# Altium project LimeSDR-PCIe_1v3.PrjPcb (part 3 of 7)

## Sheet 10_FPGA_misc.SchDoc: FPGA misc
size A4; Organization: Lime Microsystems; Address1: Surrey Tech Centre; Address2: Guildford GU2 7YG; Address3: Surrey; Address4: United Kingdom; Revision: v1.3; SheetNumber: 10; SheetTotal: 16
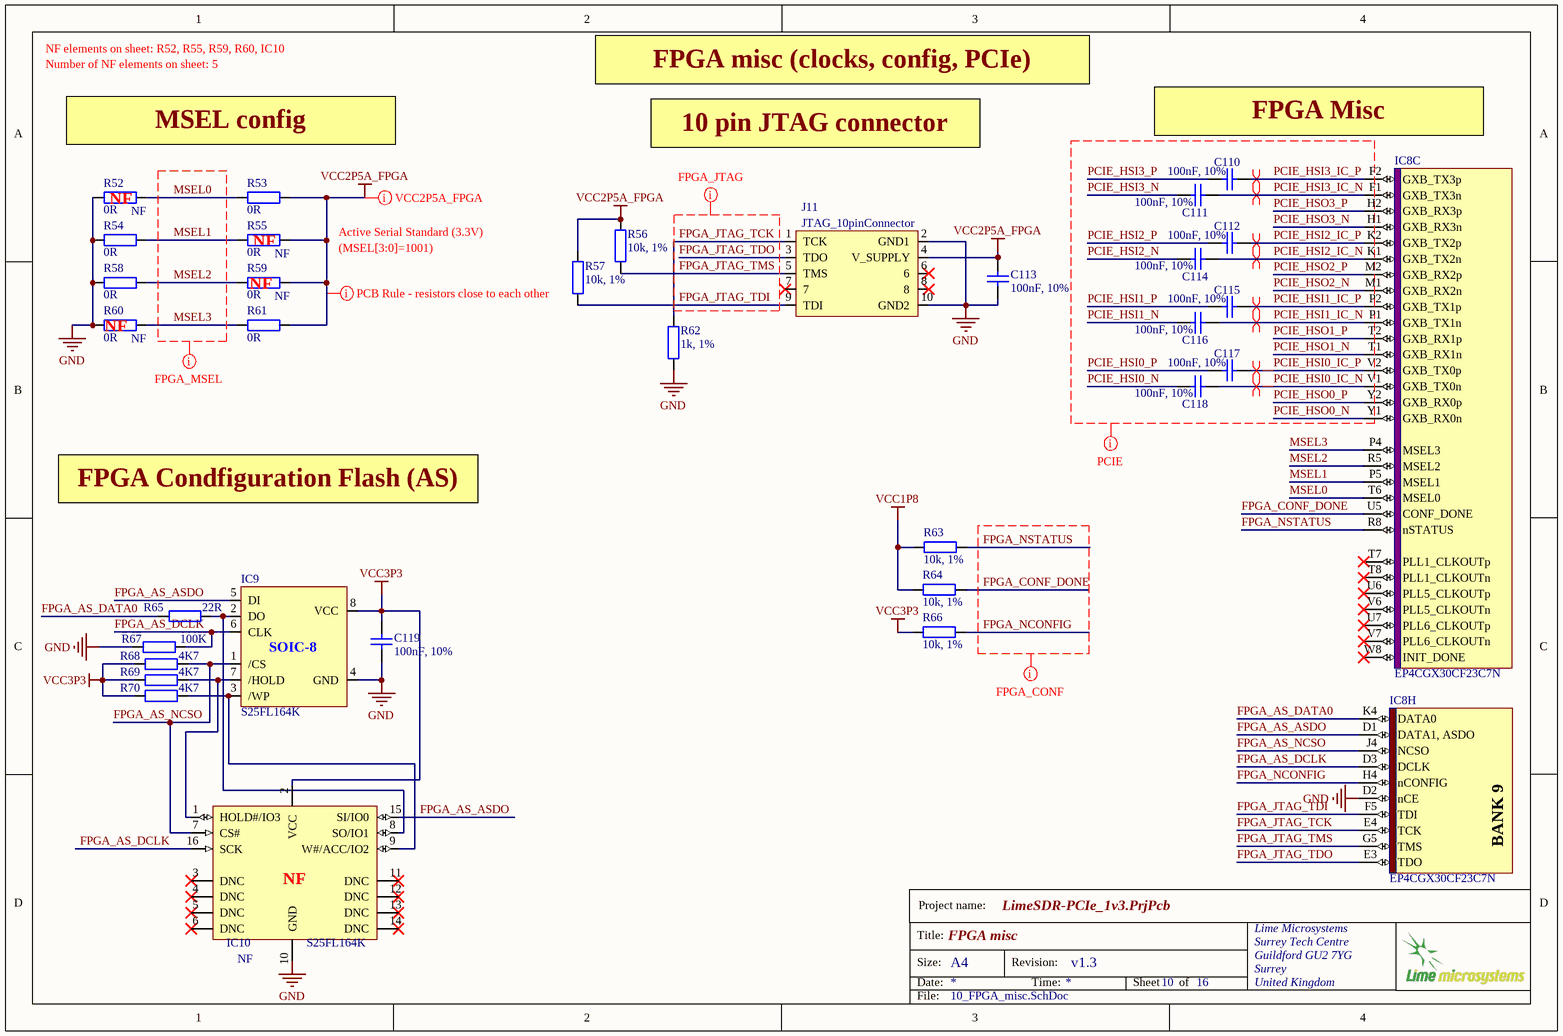
[diagram p10: 10_FPGA_misc.SchDoc]

### Parts
C110  100nF, 10%  [CAP0402]
C111  100nF, 10%  [CAP0402]
C112  100nF, 10%  [CAP0402]
C113  100nF, 10%  [CAP0402]
C114  100nF, 10%  [CAP0402]
C115  100nF, 10%  [CAP0402]
C116  100nF, 10%  [CAP0402]
C117  100nF, 10%  [CAP0402]
C118  100nF, 10%  [CAP0402]
C119  100nF, 10%  [CAP0402]
IC8  EP4CGX30CF23C7N  [ALTR-FBGA484_A-200]  (parts C,H of 10)
IC9  S25FL164K  [S25FL164K_WSO8N]
IC10  S25FL164K  Assembly Info: NF  [SOIC16_WIDE]
J11  JTAG_10pinConnector  [HEADER5x2_SM]
R52  0R  Assembly Info: NF  [RES0402]
R53  0R  [RES0402]
R54  0R  [RES0402]
R55  0R  Assembly Info: NF  [RES0402]
R56  10k, 1%  [RES0402]
R57  10k, 1%  [RES0402]
R58  0R  [RES0402]
R59  0R  Assembly Info: NF  [RES0402]
R60  0R  Assembly Info: NF  [RES0402]
R61  0R  [RES0402]
R62  1k, 1%  [RES0402]
R63  10k, 1%  [RES0402]
R64  10k, 1%  [RES0402]
R65  22R  [RES0402]
R66  10k, 1%  [RES0402]
R67  100K  [RES0402]
R68  4K7  [RES0402]
R69  4K7  [RES0402]
R70  4K7  [RES0402]

### Nets
GND: C113.2 C119.2 IC8.D2(nCE) IC9.4(GND) IC10.10(GND) J11.2(GND1) J11.10(GND2) R52.2 R54.2 R58.2 R60.2 R62.2 R67.2
VCC1P8: R63.1 R64.1
VCC2P5A_FPGA: C113.1 J11.4(V_SUPPLY) R53.1 R55.1 R56.1 R57.1 R59.1 R61.1
VCC3P3: C119.1 IC9.8(VCC) IC10.2(VCC) R66.1 R68.1 R69.1 R70.1
FPGA_AS_ASDO: IC8.D1(DATA1,_ASDO) IC9.5(DI) IC10.15(SI/IO0)
FPGA_AS_DATA0: IC8.K4(DATA0) R65.2
FPGA_AS_DCLK: IC8.D3(DCLK) IC9.6(CLK) IC10.16(SCK) R67.1
FPGA_AS_NCSO: IC8.J4(NCSO) IC9.1(/CS) IC10.7(CS#) R68.2
FPGA_CONF_DONE: IC8.U5(CONF_DONE) R64.2
FPGA_JTAG_TCK: IC8.E4(TCK) J11.1(TCK) R62.1
FPGA_JTAG_TDI: IC8.F5(TDI) J11.9(TDI) R57.2
FPGA_JTAG_TDO: IC8.E3(TDO) J11.3(TDO)
FPGA_JTAG_TMS: IC8.G5(TMS) J11.5(TMS) R56.2
FPGA_NCONFIG: IC8.H4(nCONFIG) R66.2
FPGA_NSTATUS: IC8.R8(nSTATUS) R63.2
MSEL0: IC8.T6(MSEL0) R52.1 R53.2
MSEL1: IC8.P5(MSEL1) R54.1 R55.2
MSEL2: IC8.R5(MSEL2) R58.1 R59.2
MSEL3: IC8.P4(MSEL3) R60.1 R61.2
PCIE_HSI0_IC_N: C118.1 IC8.V1(GXB_TX0n)
PCIE_HSI0_IC_P: C117.1 IC8.V2(GXB_TX0p)
PCIE_HSI0_N: C118.2
PCIE_HSI0_P: C117.2
PCIE_HSI1_IC_N: C116.1 IC8.P1(GXB_TX1n)
PCIE_HSI1_IC_P: C115.1 IC8.P2(GXB_TX1p)
PCIE_HSI1_N: C116.2
PCIE_HSI1_P: C115.2
PCIE_HSI2_IC_N: C114.1 IC8.K1(GXB_TX2n)
PCIE_HSI2_IC_P: C112.1 IC8.K2(GXB_TX2p)
PCIE_HSI2_N: C114.2
PCIE_HSI2_P: C112.2
PCIE_HSI3_IC_N: C111.1 IC8.F1(GXB_TX3n)
PCIE_HSI3_IC_P: C110.1 IC8.F2(GXB_TX3p)
PCIE_HSI3_N: C111.2
PCIE_HSI3_P: C110.2
PCIE_HSO0_N: IC8.Y1(GXB_RX0n)
PCIE_HSO0_P: IC8.Y2(GXB_RX0p)
PCIE_HSO1_N: IC8.T1(GXB_RX1n)
PCIE_HSO1_P: IC8.T2(GXB_RX1p)
PCIE_HSO2_N: IC8.M1(GXB_RX2n)
PCIE_HSO2_P: IC8.M2(GXB_RX2p)
PCIE_HSO3_N: IC8.H1(GXB_RX3n)
PCIE_HSO3_P: IC8.H2(GXB_RX3p)
NetIC9_2: IC9.2(DO) IC10.8(SO/IO1) R65.1
NetIC9_3: IC9.3(/WP) IC10.9(W#/ACC/IO2) R70.2
NetIC9_7: IC9.7(/HOLD) IC10.1(HOLD#/IO3) R69.2

Not connected (* = marked no-connect by the designer): IC8 T7(PLL1_CLKOUTp)* T8(PLL1_CLKOUTn)* U6(PLL5_CLKOUTp)* U7(PLL6_CLKOUTp)* V6(PLL5_CLKOUTn)* V7(PLL6_CLKOUTn)* W8(INIT_DONE)*; IC10 3(DNC)* 4(DNC)* 5(DNC)* 6(DNC)* 11(DNC)* 12(DNC)* 13(DNC)* 14(DNC)*; J11 6* 7* 8*

### Layout directives
net class FPGA_JTAG: FPGA_JTAG_TCK, FPGA_JTAG_TDI, FPGA_JTAG_TDO, FPGA_JTAG_TMS
net class FPGA_CONF: FPGA_CONF_DONE, FPGA_NCONFIG, FPGA_NSTATUS
rule Undefined: VCC2P5A_FPGA
net class FPGA_MSEL: MSEL0, MSEL1, MSEL2, MSEL3
differential pair: PCIE_HSI0_IC_N, PCIE_HSI0_IC_P, PCIE_HSI1_IC_N, PCIE_HSI1_IC_P, PCIE_HSI2_IC_N, PCIE_HSI2_IC_P, PCIE_HSI3_IC_N, PCIE_HSI3_IC_P
net class PCIE: PCIE_HSI0_IC_N, PCIE_HSI0_IC_P, PCIE_HSI0_N, PCIE_HSI0_P, PCIE_HSI1_IC_N, PCIE_HSI1_IC_P, PCIE_HSI1_N, PCIE_HSI1_P, PCIE_HSI2_IC_N, PCIE_HSI2_IC_P, PCIE_HSI2_N, PCIE_HSI2_P, PCIE_HSI3_IC_N, PCIE_HSI3_IC_P, PCIE_HSI3_N, PCIE_HSI3_P, PCIE_HSO0_N, PCIE_HSO0_P, PCIE_HSO1_N, PCIE_HSO1_P, PCIE_HSO2_N, PCIE_HSO2_P, PCIE_HSO3_N, PCIE_HSO3_P
net class VCC2P5A_FPGA: VCC2P5A_FPGA

### Notes on the sheet
- NF elements on sheet: R52, R55, R59, R60, IC10
- Number of NF elements on sheet: 5
- FPGA misc (clocks, config, PCIe)
- MSEL config
- 10 pin JTAG connector
- FPGA Misc
- (near R52) NF
- (near R55) NF
- Active Serial Standard (3.3V)
- (near R59) NF
- (MSEL[3:0]=1001)
- (near R60) NF
- FPGA Condfiguration Flash (AS)
- (near IC10) NF
- Project name:
- Title:
- Size:
- Date:
- A4
- Revision:
- Time:
- Sheet
- of
- File:
- (in symbol EP4CGX30CF23C7N, part H) BANK 9
- (in symbol W25Q32FV) SOIC-8

### Library data of the parts
C110 = Cap_0603: Part Description: 0.10µF ±10% 16V X7R Ceramic Capacitor -55°C ~ 125°C Surface Mount, MLCC 0402 (1005 Metric) 0.039" L x 0.020" W (1.00mm x 0.50mm); Manufacturer Part Number 1: GRM155R71C104KA88D; Brand: Murata Electronics; Type: General Purpose MLCC; Capacitance: 0.1 uF; Temperature Coefficient / Code: +/- 15 %; Voltage Rating DC: 16 V; Case Height: 0.5 mm; Case Length: 1 mm; Dielectric: X7R; Supplier 1: Mouser; Supplier Part Number 1: 81-GRM155R71C104KA88; Tolerance: 10 %; Case Code - in: 0402; Manufacturer: Murata Electronics; Category: Multilayer Ceramic Capacitors MLCC - SMD/SMT; Value: 100nF, 10%; Case Code - mm: 1005; Case Width: 0.5 mm; Manufacturer Part Number: GRM155R71C104KA88D; Maximum Operating Temperature: + 125 C; Minimum Operating Temperature: - 55 C; Minimum Order Quantity: 1; Operating Temperature Range: - 55 C to + 125 C; Package / Case: 0402 (1005 metric); Packaging: Reel; Product: General Type MLCCs; Product Category: Low & Medium Capacitance SMD Ceramic Chip Capacitors; Reeling: True; RoHS - Mouser: Y; RoHS: RoHS Compliant; Series: GRM; Standard Pack Qty: 10000; Termination Style: SMD/SMT
C111-C118 = Cap_0603: Part Description: 0.10µF ±10% 16V X7R Ceramic Capacitor -55°C ~ 125°C Surface Mount, MLCC 0402 (1005 Metric) 0.039" L x 0.020" W (1.00mm x 0.50mm); Manufacturer Part Number 1: GRM155R71C104KA88D; Brand: Murata Electronics; Type: General Purpose MLCC; Capacitance: 0.1 uF; Temperature Coefficient / Code: +/- 15 %; Voltage Rating DC: 16 V; Supplier 1: Mouser; Supplier Part Number 1: 81-GRM155R71C104KA88; Tolerance: 10 %; Case Code - in: 0402; Manufacturer: Murata Electronics; Category: Multilayer Ceramic Capacitors MLCC - SMD/SMT; Value: 100nF, 10%; Manufacturer Part Number: GRM155R71C104KA88D; Maximum Operating Temperature: + 125 C; Minimum Operating Temperature: - 55 C; Minimum Order Quantity: 1; Operating Temperature Range: - 55 C to + 125 C; Package / Case: 0402 (1005 metric); Packaging: Reel; Product: General Type MLCCs; Product Category: Low & Medium Capacitance SMD Ceramic Chip Capacitors; Reeling: True; RoHS - Mouser: Y; RoHS: RoHS Compliant; Series: GRM; Standard Pack Qty: 10000; Termination Style: SMD/SMT
C119 = Cap_0603: Manufacturer Part Number 1: GRM155R71C104KA88D; Part Description: 0.10µF ±10% 16V X7R Ceramic Capacitor -55°C ~ 125°C Surface Mount, MLCC 0402 (1005 Metric) 0.039" L x 0.020" W (1.00mm x 0.50mm); Brand: Murata Electronics; Type: General Purpose MLCC; Capacitance: 0.1 uF; Temperature Coefficient / Code: +/- 15 %; Voltage Rating DC: 16 V; Supplier 1: Mouser; Supplier Part Number 1: 81-GRM155R71C104KA88; Tolerance: 10 %; Case Code - in: 0402; Manufacturer: Murata Electronics; Category: Multilayer Ceramic Capacitors MLCC - SMD/SMT; Value: 100nF, 10%; Manufacturer Part Number: GRM155R71C104KA88D; Maximum Operating Temperature: + 125 C; Minimum Operating Temperature: - 55 C; Minimum Order Quantity: 1; Operating Temperature Range: - 55 C to + 125 C; Package / Case: 0402 (1005 metric); Packaging: Reel; Product: General Type MLCCs; Product Category: Low & Medium Capacitance SMD Ceramic Chip Capacitors; Reeling: True; RoHS - Mouser: Y; RoHS: RoHS Compliant; Series: GRM; Standard Pack Qty: 10000; Termination Style: SMD/SMT
IC8 = EP4CGX30CF23C7N: Manufacturer: Altera; Part Description: IC FPGA 290 I/O 484FBGA; Voltage - Supply: 1.16 V ~ 1.24 V; Number of I/O: 290; Total RAM Bits: 1105920; Number of Logic Elements/Cells: 29440; Number of LABs/CLBs: 1840; Supplier 1: Digi-Key; Package / Case: 484-BGA; Operating Temperature: 0°C ~ 85°C; Mounting Type: Surface Mount; Number of Gates: -; Supplier Device Package: 484-FBGA (23x23); Category: Integrated Circuits (ICs); RoHS: RoHS Compliant; Supplier Part Number 1: 544-2730-ND; Manufacturer Part Number 1: EP4CGX30CF23C7N
IC9 = W25Q32FV: Manufacturer: Cypress Semiconductor Corp; Manufacturer Part Number 1: S25FL164K0XMFI011; Part Description: IC FLASH 64MBIT 8SO; Voltage - Supply: 2.7 V ~ 3.6 V; Memory Type: FLASH - NOR; Interface: SPI Serial; Memory Size: 64M (8M x 8); Speed: 108MHz; Format - Memory: FLASH; Supplier 1: Digi-Key; Supplier Part Number 1: 1274-1097-ND; Packaging: Tube; Category: Integrated Circuits (ICs); RoHS: RoHS Compliant; Operating Temperature: -40°C ~ 85°C (TA); Package / Case: 8-SOIC (0.209", 5.30mm Width); Supplier Device Package: 8-SO
IC10 = S25FL032P: Manufacturer: Cypress Semiconductor Corp; Manufacturer Part Number 1: S25FL164K0XMFI003; Part Description: IC FLASH 64MBIT 108MHZ 16SOIC; Format - Memory: FLASH; Memory Type: FLASH - NOR; Memory Size: 64M (8M x 8); Speed: 108MHz; Interface: SPI Serial; Voltage - Supply: 2.7 V ~ 3.6 V; Supplier 1: Digi-Key; Supplier Part Number 1: 1274-1109-1-ND; RoHS: RoHS Compliant; Category: Integrated Circuits (ICs); Stock 1: 2398; Pricing 1: 1=1.27, 10=1.157, 25=1.1256, 50=1.1196, 100=1.0009, 250=0.99792, 500=0.98308 (USD); Packaging: Cut Tape (CT); Part Status: Active; Operating Temperature: -40°C ~ 85°C (TA); Package / Case: 16-SOIC (0.295", 7.50mm Width); Supplier Device Package: 16-SO; ComponentLink1URL: http://www.cypress.com/file/196886/download; ComponentLink1Description: http://www.cypress.com/file/196886/download
J11 = JTAG_connector_10pin: Manufacturer Part Number 1: 54202-G0805LF; Part Description: 10 Positions Header, Unshrouded Connector 0.100" (2.54mm) Surface Mount Gold or Gold, GXT; Manufacturer: MOLEX; Connector Type: Header, Unshrouded; Number of Positions: 10; Number of Positions Loaded: All; Supplier 1: Digi-Key; Supplier Part Number 1: 609-4723-ND; Contact Type: Male Pin; Category: Connectors, Interconnects; Contact Finish: Gold or Gold, GXT™; Color: Black; Number of Rows: 2; Mounting Type: Surface Mount
R52-R55 R58-R61 = Res_0402: Manufacturer: Yageo; Part Description: RES SMD 0.0OHM JUMPER 1/16W 0402; Supplier 1: Digi-Key; Supplier Part Number 1: 311-0.0JRTR-ND; Composition: Thick Film; Package / Case: 0402 (1005 Metric); Category: Resistors; Value: 0R
R56 R57 R63 R64 R66 = Res_0402: Manufacturer: Yageo; Manufacturer Part Number 1: RC0402FR-0710KL; Part Description: RES SMD 10K OHM 1% 1/16W 0402; Temperature Coefficient: ±100ppm/°C; Power (Watts): 0.063W, 1/16W; Value: 10k, 1%; Supplier 1: Digi-Key; Supplier Part Number 1: 311-10.0KLRTR-ND; Resistance (Ohms): 10k; Packaging: Tape & Reel (TR); RoHS: RoHS Compliant; Package / Case: 0402 (1005 Metric); Tolerance: ±1%; Operating Temperature: -55°C ~ 155°C; Size / Dimension: 0.039" L x 0.020" W (1.00mm x 0.50mm); Number of Terminations: 2; Category: Resistors; Height: 0.016" (0.40mm); Supplier Device Package: 0402; Features: Moisture Resistant; Composition: Thick Film
R62 = Res_0402: Manufacturer: Stackpole Electronics Inc; Manufacturer Part Number 1: RMCF0402FT1K00; Part Description: RES SMD 1K OHM 1% 1/16W 0402; Temperature Coefficient: ±100ppm/°C; Power (Watts): 0.063W, 1/16W; Value: 1k, 1%; Supplier 1: Digi-Key; Supplier Part Number 1: RMCF0402FT1K00TR-ND; Package / Case: 0402 (1005 Metric); Supplier Device Package: 0402; Height: 0.016" (0.40mm); Size / Dimension: 0.039" L x 0.020" W (1.00mm x 0.50mm); Number of Terminations: 2; Packaging: Cut Tape (CT); Category: Resistors; Composition: Thick Film; Resistance (Ohms): 1k; Tolerance: ±1%; Features: Moisture Resistant; Operating Temperature: -55°C ~ 155°C; RoHS: RoHS Compliant
R65 = Res_0402: Part Description: RES SMD 22 OHM 1% 1/16W 0402; Manufacturer: Yageo; Tolerance: ±1%; Temperature Coefficient: ±100ppm/°C; Resistance (Ohms): 22; Supplier 1: Digi-Key; Supplier Part Number 1: 311-22.0LRTR-ND; Supplier Device Package: 0402; Composition: Thick Film; Category: Resistors; Value: 22R
R67 = Res_0402: Manufacturer Part Number 1: ERJ-2GEJ104X; Manufacturer: Panasonic Electronic Components; Part Description: RES SMD 100K OHM 5% 1/10W 0402; Tolerance: ±5%; Temperature Coefficient: ±200ppm/°C; Power (Watts): 0.1W, 1/10W; Supplier 1: Digi-Key; Supplier Part Number 1: P100KJCT-ND; Resistance (Ohms): 100k; Composition: Thick Film; Features: Automotive AEC-Q200; Number of Terminations: 2; Height: 0.016" (0.40mm); RoHS: RoHS Compliant; Package / Case: 0402 (1005 Metric); Packaging: Cut Tape (CT); Size / Dimension: 0.039" L x 0.020" W (1.00mm x 0.50mm); Supplier Device Package: 0402; Operating Temperature: -55°C ~ 155°C; Category: Resistors; value: 100K
R68-R70 = Res_0402: Manufacturer Part Number 1: RMCF0402JT4K70; Part Description: RES SMD 4.7K OHM 5% 1/16W 0402; Manufacturer: Stackpole Electronics Inc.; Temperature Coefficient: ±100ppm/°C; Resistance(Ohms): 4.7k; Tolerance: ±5%; Supplier 1: Digi-Key; Composition: Thick Film; Supplier Device Package: 0402; Supplier: Digi-Key; Supplier Part Number 1: RMCF0402JT4K70TR-ND; Category: Resistors; Value: 4K7

## Sheet 11_FPGA_power.SchDoc: FPGA power
size A3; Organization: Lime Microsystems; Address1: Surrey Tech Centre; Address2: Guildford GU2 7YG; Address3: Surrey; Address4: United Kingdom; Revision: v1.3; SheetNumber: 11; SheetTotal: 16
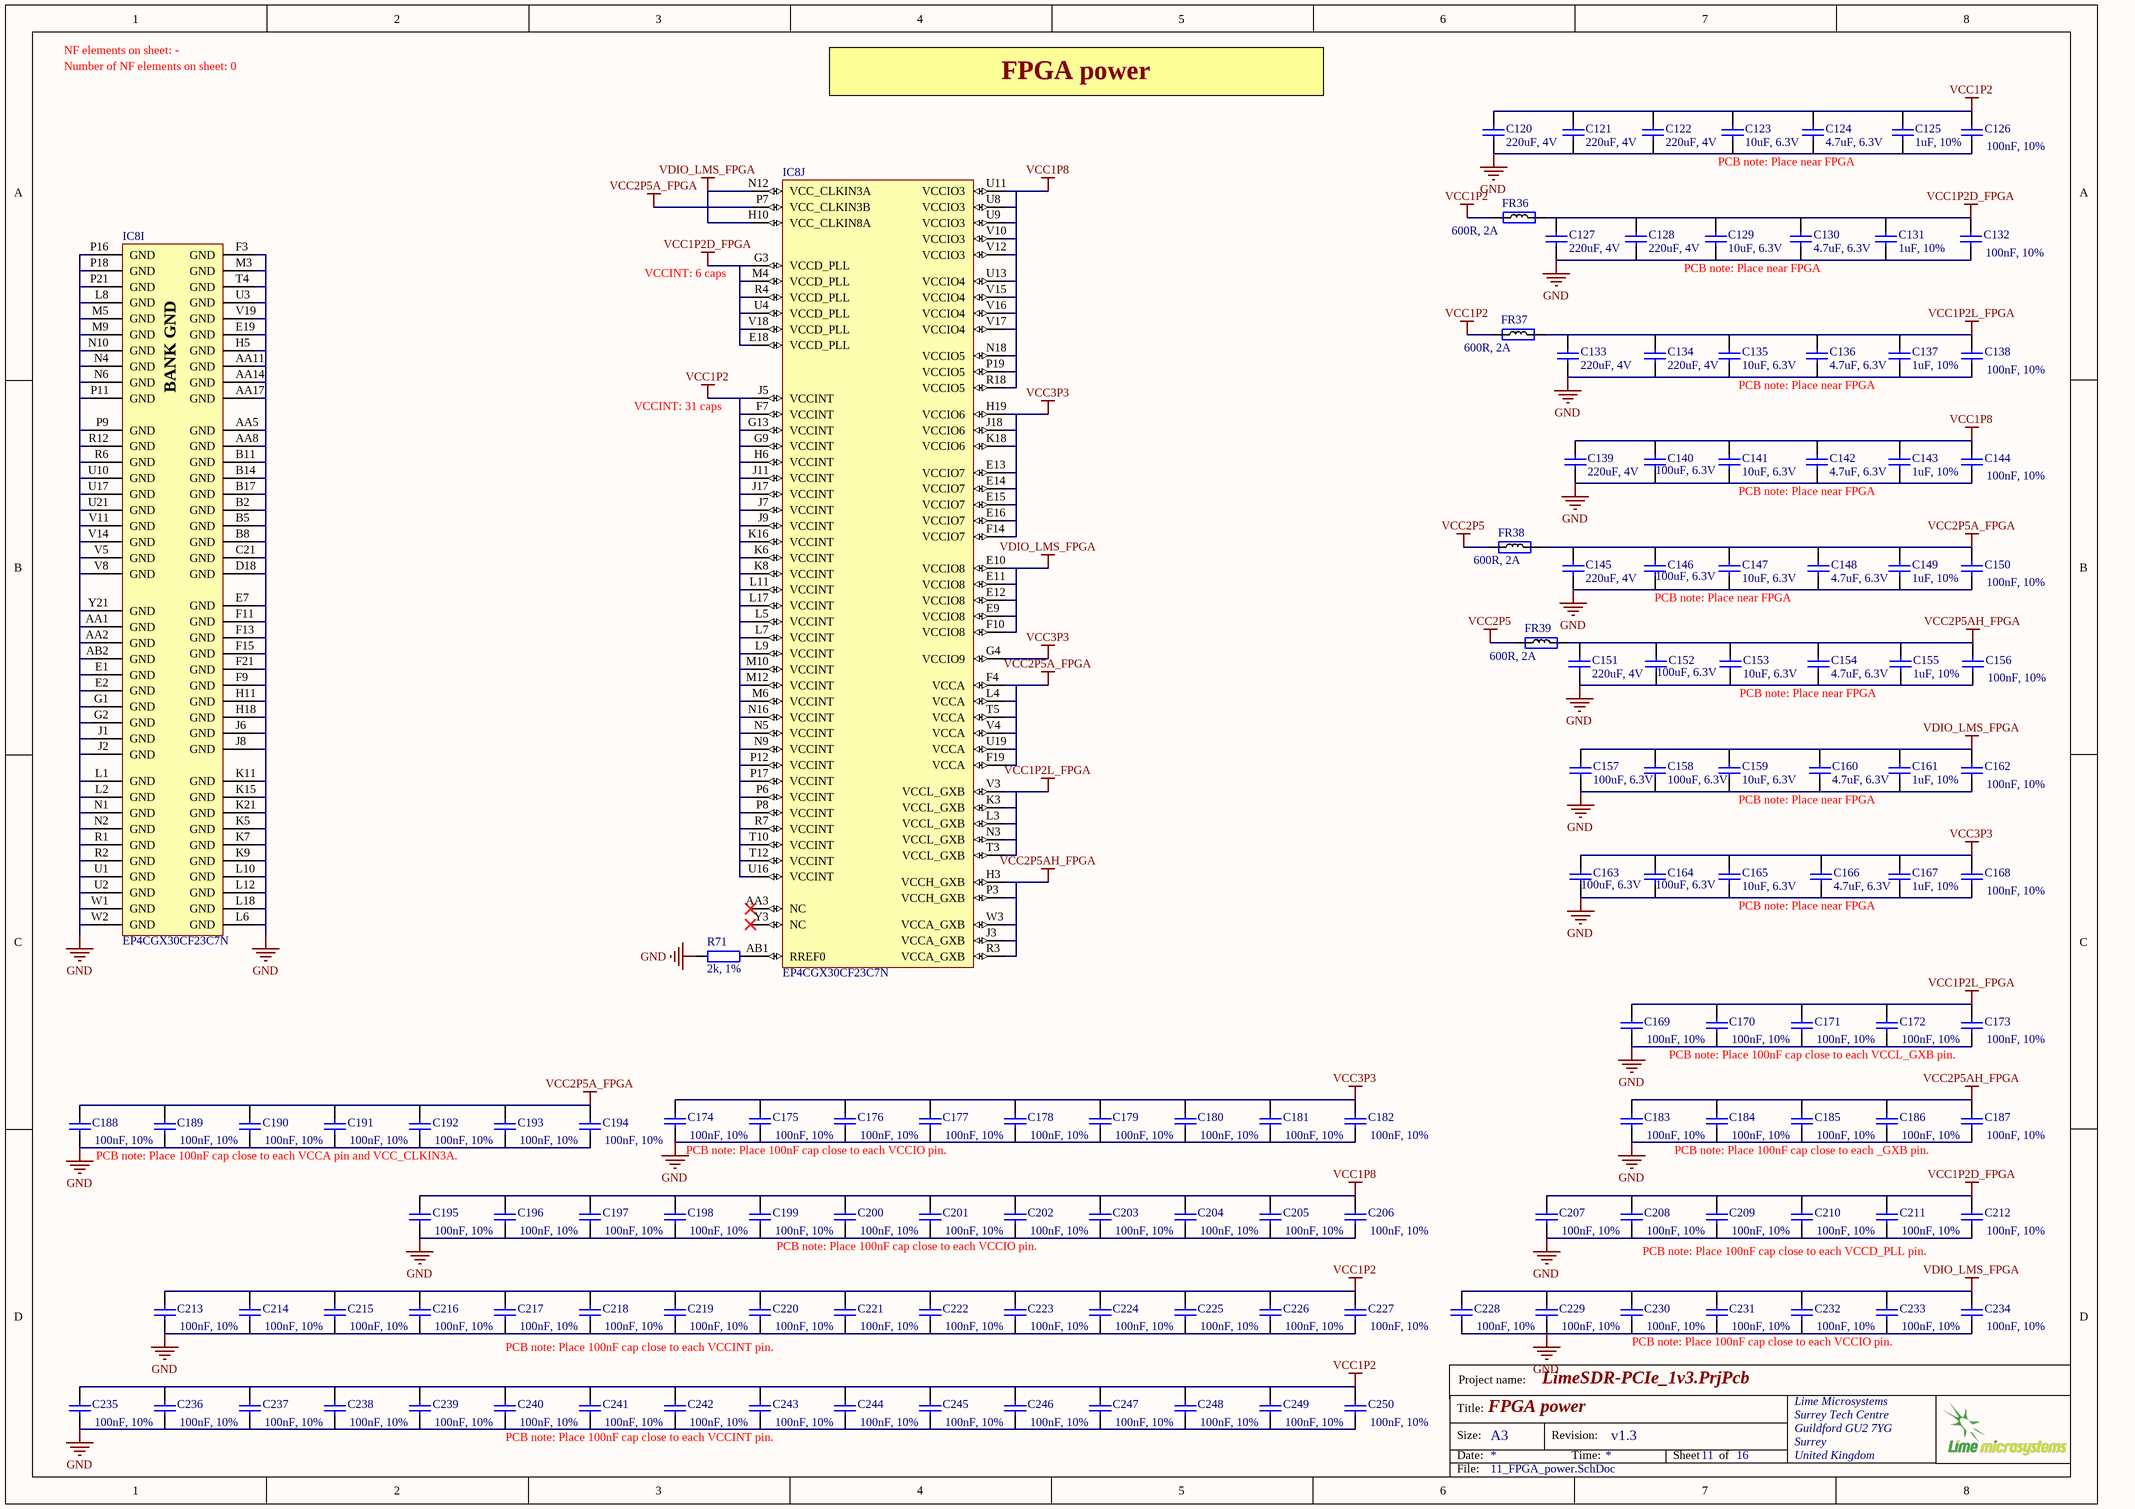
[diagram p11: 11_FPGA_power.SchDoc]

### Parts
C120  220uF, 4V  [CAP1206]
C121  220uF, 4V  [CAP1206]
C122  220uF, 4V  [CAP1206]
C123  10uF, 6.3V  [CAP0603]
C124  4.7uF, 6.3V  [CAP0402]
C125  1uF, 10%  [CAP0402]
C126  100nF, 10%  [CAP0402]
C127  220uF, 4V  [CAP1206]
C128  220uF, 4V  [CAP1206]
C129  10uF, 6.3V  [CAP0603]
C130  4.7uF, 6.3V  [CAP0402]
C131  1uF, 10%  [CAP0402]
C132  100nF, 10%  [CAP0402]
C133  220uF, 4V  [CAP1206]
C134  220uF, 4V  [CAP1206]
C135  10uF, 6.3V  [CAP0603]
C136  4.7uF, 6.3V  [CAP0402]
C137  1uF, 10%  [CAP0402]
C138  100nF, 10%  [CAP0402]
C139  220uF, 4V  [CAP1206]
C140  100uF, 6.3V  [CAP1206]
C141  10uF, 6.3V  [CAP0603]
C142  4.7uF, 6.3V  [CAP0402]
C143  1uF, 10%  [CAP0402]
C144  100nF, 10%  [CAP0402]
C145  220uF, 4V  [CAP1206]
C146  100uF, 6.3V  [CAP1206]
C147  10uF, 6.3V  [CAP0603]
C148  4.7uF, 6.3V  [CAP0402]
C149  1uF, 10%  [CAP0402]
C150  100nF, 10%  [CAP0402]
C151  220uF, 4V  [CAP1206]
C152  100uF, 6.3V  [CAP1206]
C153  10uF, 6.3V  [CAP0603]
C154  4.7uF, 6.3V  [CAP0402]
C155  1uF, 10%  [CAP0402]
C156  100nF, 10%  [CAP0402]
C157  100uF, 6.3V  [CAP1206]
C158  100uF, 6.3V  [CAP1206]
C159  10uF, 6.3V  [CAP0603]
C160  4.7uF, 6.3V  [CAP0402]
C161  1uF, 10%  [CAP0402]
C162  100nF, 10%  [CAP0402]
C163  100uF, 6.3V  [CAP1206]
C164  100uF, 6.3V  [CAP1206]
C165  10uF, 6.3V  [CAP0603]
C166  4.7uF, 6.3V  [CAP0402]
C167  1uF, 10%  [CAP0402]
C168  100nF, 10%  [CAP0402]
C169  100nF, 10%  [CAP0402]
C170  100nF, 10%  [CAP0402]
C171  100nF, 10%  [CAP0402]
C172  100nF, 10%  [CAP0402]
C173  100nF, 10%  [CAP0402]
C174  100nF, 10%  [CAP0402]
C175  100nF, 10%  [CAP0402]
C176  100nF, 10%  [CAP0402]
C177  100nF, 10%  [CAP0402]
C178  100nF, 10%  [CAP0402]
C179  100nF, 10%  [CAP0402]
C180  100nF, 10%  [CAP0402]
C181  100nF, 10%  [CAP0402]
C182  100nF, 10%  [CAP0402]
C183  100nF, 10%  [CAP0402]
C184  100nF, 10%  [CAP0402]
C185  100nF, 10%  [CAP0402]
C186  100nF, 10%  [CAP0402]
C187  100nF, 10%  [CAP0402]
C188  100nF, 10%  [CAP0402]
C189  100nF, 10%  [CAP0402]
C190  100nF, 10%  [CAP0402]
C191  100nF, 10%  [CAP0402]
C192  100nF, 10%  [CAP0402]
C193  100nF, 10%  [CAP0402]
C194  100nF, 10%  [CAP0402]
C195  100nF, 10%  [CAP0402]
C196  100nF, 10%  [CAP0402]
C197  100nF, 10%  [CAP0402]
C198  100nF, 10%  [CAP0402]
C199  100nF, 10%  [CAP0402]
C200  100nF, 10%  [CAP0402]
C201  100nF, 10%  [CAP0402]
C202  100nF, 10%  [CAP0402]
C203  100nF, 10%  [CAP0402]
C204  100nF, 10%  [CAP0402]
C205  100nF, 10%  [CAP0402]
C206  100nF, 10%  [CAP0402]
C207  100nF, 10%  [CAP0402]
C208  100nF, 10%  [CAP0402]
C209  100nF, 10%  [CAP0402]
C210  100nF, 10%  [CAP0402]
C211  100nF, 10%  [CAP0402]
C212  100nF, 10%  [CAP0402]
C213  100nF, 10%  [CAP0402]
C214  100nF, 10%  [CAP0402]
C215  100nF, 10%  [CAP0402]
C216  100nF, 10%  [CAP0402]
C217  100nF, 10%  [CAP0402]
C218  100nF, 10%  [CAP0402]
C219  100nF, 10%  [CAP0402]
C220  100nF, 10%  [CAP0402]
C221  100nF, 10%  [CAP0402]
C222  100nF, 10%  [CAP0402]
C223  100nF, 10%  [CAP0402]
C224  100nF, 10%  [CAP0402]
C225  100nF, 10%  [CAP0402]
C226  100nF, 10%  [CAP0402]
C227  100nF, 10%  [CAP0402]
C228  100nF, 10%  [CAP0402]
C229  100nF, 10%  [CAP0402]
C230  100nF, 10%  [CAP0402]
C231  100nF, 10%  [CAP0402]
C232  100nF, 10%  [CAP0402]
C233  100nF, 10%  [CAP0402]
C234  100nF, 10%  [CAP0402]
C235  100nF, 10%  [CAP0402]
C236  100nF, 10%  [CAP0402]
C237  100nF, 10%  [CAP0402]
C238  100nF, 10%  [CAP0402]
C239  100nF, 10%  [CAP0402]
C240  100nF, 10%  [CAP0402]
C241  100nF, 10%  [CAP0402]
C242  100nF, 10%  [CAP0402]
C243  100nF, 10%  [CAP0402]
C244  100nF, 10%  [CAP0402]
C245  100nF, 10%  [CAP0402]
C246  100nF, 10%  [CAP0402]
C247  100nF, 10%  [CAP0402]
C248  100nF, 10%  [CAP0402]
C249  100nF, 10%  [CAP0402]
C250  100nF, 10%  [CAP0402]
FR36  600R, 2A  [RES0805]
FR37  600R, 2A  [RES0805]
FR38  600R, 2A  [RES0805]
FR39  600R, 2A  [RES0805]
IC8  EP4CGX30CF23C7N  [ALTR-FBGA484_A-200]  (parts I,J of 10)
R71  2k, 1%  [RES0402]

### Nets
GND: C120.1 C121.1 C122.1 C123.1 C124.1 C125.2 C126.2 C127.1 C128.1 C129.1 C130.1 C131.2 C132.2 C133.1 C134.1 C135.1 C136.1 C137.1 C138.2 C139.1 C140.1 C141.1 C142.1 C143.1 C144.2 C145.1 C146.1 C147.1 C148.1 C149.1 C150.2 C151.1 C152.1 C153.1 C154.1 C155.1 C156.2 C157.1 C158.1 C159.1 C160.1 C161.1 C162.2 C163.1 C164.1 C165.1 C166.1 C167.1 C168.2 C169.2 C170.2 C171.2 C172.2 C173.2 C174.2 C175.2 C176.2 C177.2 C178.2 C179.2 C180.2 C181.2 C182.2 C183.2 C184.2 C185.2 C186.2 C187.2 C188.2 C189.2 C190.2 C191.2 C192.2 C193.2 C194.2 C195.2 C196.2 C197.2 C198.2 C199.2 C200.2 C201.2 C202.2 C203.2 C204.2 C205.2 C206.2 C207.2 C208.2 C209.2 C210.2 C211.2 C212.2 C213.2 C214.2 C215.2 C216.2 C217.2 C218.2 C219.2 C220.2 C221.2 C222.2 C223.2 C224.2 C225.2 C226.2 C227.2 C228.2 C229.2 C230.2 C231.2 C232.2 C233.2 C234.2 C235.2 C236.2 C237.2 C238.2 C239.2 C240.2 C241.2 C242.2 C243.2 C244.2 C245.2 C246.2 C247.2 C248.2 C249.2 C250.2 IC8.AA1(GND) IC8.AA2(GND) IC8.AA5(GND) IC8.AA8(GND) IC8.AA11(GND) IC8.AA14(GND) IC8.AA17(GND) IC8.AB2(GND) IC8.B2(GND) IC8.B5(GND) IC8.B8(GND) IC8.B11(GND) IC8.B14(GND) IC8.B17(GND) IC8.C21(GND) IC8.D18(GND) IC8.E1(GND) IC8.E2(GND) IC8.E7(GND) IC8.E19(GND) IC8.F3(GND) IC8.F9(GND) IC8.F11(GND) IC8.F13(GND) IC8.F15(GND) IC8.F21(GND) IC8.G1(GND) IC8.G2(GND) IC8.H5(GND) IC8.H11(GND) IC8.H18(GND) IC8.J1(GND) IC8.J2(GND) IC8.J6(GND) IC8.J8(GND) IC8.K5(GND) IC8.K7(GND) IC8.K9(GND) IC8.K11(GND) IC8.K15(GND) IC8.K21(GND) IC8.L1(GND) IC8.L2(GND) IC8.L6(GND) IC8.L8(GND) IC8.L10(GND) IC8.L12(GND) IC8.L18(GND) IC8.M3(GND) IC8.M5(GND) IC8.M9(GND) IC8.N1(GND) IC8.N2(GND) IC8.N4(GND) IC8.N6(GND) IC8.N10(GND) IC8.P9(GND) IC8.P11(GND) IC8.P16(GND) IC8.P18(GND) IC8.P21(GND) IC8.R1(GND) IC8.R2(GND) IC8.R6(GND) IC8.R12(GND) IC8.T4(GND) IC8.U1(GND) IC8.U2(GND) IC8.U3(GND) IC8.U10(GND) IC8.U17(GND) IC8.U21(GND) IC8.V5(GND) IC8.V8(GND) IC8.V11(GND) IC8.V14(GND) IC8.V19(GND) IC8.W1(GND) IC8.W2(GND) IC8.Y21(GND) R71.2
VCC1P2: C120.2 C121.2 C122.2 C123.2 C124.2 C125.1 C126.1 C213.1 C214.1 C215.1 C216.1 C217.1 C218.1 C219.1 C220.1 C221.1 C222.1 C223.1 C224.1 C225.1 C226.1 C227.1 C235.1 C236.1 C237.1 C238.1 C239.1 C240.1 C241.1 C242.1 C243.1 C244.1 C245.1 C246.1 C247.1 C248.1 C249.1 C250.1 FR36.1 FR37.1 IC8.F7(VCCINT) IC8.G9(VCCINT) IC8.G13(VCCINT) IC8.H6(VCCINT) IC8.J5(VCCINT) IC8.J7(VCCINT) IC8.J9(VCCINT) IC8.J11(VCCINT) IC8.J17(VCCINT) IC8.K6(VCCINT) IC8.K8(VCCINT) IC8.K16(VCCINT) IC8.L5(VCCINT) IC8.L7(VCCINT) IC8.L9(VCCINT) IC8.L11(VCCINT) IC8.L17(VCCINT) IC8.M6(VCCINT) IC8.M10(VCCINT) IC8.M12(VCCINT) IC8.N5(VCCINT) IC8.N9(VCCINT) IC8.N16(VCCINT) IC8.P6(VCCINT) IC8.P8(VCCINT) IC8.P12(VCCINT) IC8.P17(VCCINT) IC8.R7(VCCINT) IC8.T10(VCCINT) IC8.T12(VCCINT) IC8.U16(VCCINT)
VCC1P2D_FPGA: C127.2 C128.2 C129.2 C130.2 C131.1 C132.1 C207.1 C208.1 C209.1 C210.1 C211.1 C212.1 FR36.2 IC8.E18(VCCD_PLL) IC8.G3(VCCD_PLL) IC8.M4(VCCD_PLL) IC8.R4(VCCD_PLL) IC8.U4(VCCD_PLL) IC8.V18(VCCD_PLL)
VCC1P2L_FPGA: C133.2 C134.2 C135.2 C136.2 C137.2 C138.1 C169.1 C170.1 C171.1 C172.1 C173.1 FR37.2 IC8.K3(VCCL_GXB) IC8.L3(VCCL_GXB) IC8.N3(VCCL_GXB) IC8.T3(VCCL_GXB) IC8.V3(VCCL_GXB)
VCC1P8: C139.2 C140.2 C141.2 C142.2 C143.2 C144.1 C195.1 C196.1 C197.1 C198.1 C199.1 C200.1 C201.1 C202.1 C203.1 C204.1 C205.1 C206.1 IC8.N18(VCCIO5) IC8.P19(VCCIO5) IC8.R18(VCCIO5) IC8.U8(VCCIO3) IC8.U9(VCCIO3) IC8.U11(VCCIO3) IC8.U13(VCCIO4) IC8.V10(VCCIO3) IC8.V12(VCCIO3) IC8.V15(VCCIO4) IC8.V16(VCCIO4) IC8.V17(VCCIO4)
VCC2P5: FR38.1 FR39.1
VCC2P5A_FPGA: C145.2 C146.2 C147.2 C148.2 C149.2 C150.1 C188.1 C189.1 C190.1 C191.1 C192.1 C193.1 C194.1 FR38.2 IC8.F4(VCCA) IC8.F19(VCCA) IC8.L4(VCCA) IC8.P7(VCC_CLKIN3B) IC8.T5(VCCA) IC8.U19(VCCA) IC8.V4(VCCA)
VCC2P5AH_FPGA: C151.2 C152.2 C153.2 C154.2 C155.2 C156.1 C183.1 C184.1 C185.1 C186.1 C187.1 FR39.2 IC8.H3(VCCH_GXB) IC8.J3(VCCA_GXB) IC8.P3(VCCH_GXB) IC8.R3(VCCA_GXB) IC8.W3(VCCA_GXB)
VCC3P3: C163.2 C164.2 C165.2 C166.2 C167.2 C168.1 C174.1 C175.1 C176.1 C177.1 C178.1 C179.1 C180.1 C181.1 C182.1 IC8.E13(VCCIO7) IC8.E14(VCCIO7) IC8.E15(VCCIO7) IC8.E16(VCCIO7) IC8.F14(VCCIO7) IC8.G4(VCCIO9) IC8.H19(VCCIO6) IC8.J18(VCCIO6) IC8.K18(VCCIO6)
VDIO_LMS_FPGA: C157.2 C158.2 C159.2 C160.2 C161.2 C162.1 C228.1 C229.1 C230.1 C231.1 C232.1 C233.1 C234.1 IC8.E9(VCCIO8) IC8.E10(VCCIO8) IC8.E11(VCCIO8) IC8.E12(VCCIO8) IC8.F10(VCCIO8) IC8.H10(VCC_CLKIN8A) IC8.N12(VCC_CLKIN3A)
NetIC8_AB1: IC8.AB1(RREF0) R71.1

Not connected (* = marked no-connect by the designer): IC8 AA3(NC)* Y3(NC)*

### Notes on the sheet
- NF elements on sheet: -
- Number of NF elements on sheet: 0
- FPGA power
- PCB note: Place near FPGA
- (near IC8) VCCINT: 6 caps
- VCCINT: 31 caps
- PCB note: Place 100nF cap close to each VCCL_GXB pin.
- PCB note: Place 100nF cap close to each VCCA pin and VCC_CLKIN3A.
- PCB note: Place 100nF cap close to each VCCIO pin.
- PCB note: Place 100nF cap close to each _GXB pin.
- PCB note: Place 100nF cap close to each VCCD_PLL pin.
- PCB note: Place 100nF cap close to each VCCINT pin.
- Project name:
- Title:
- Size:
- Date:
- A3
- Revision:
- Time:
- Sheet
- of
- File:
- (in symbol EP4CGX30CF23C7N, part I) BANK GND

### Library data of the parts
C120-C122 C127 C128 C133 C134 C139 C145 C151 = Cap_1206: Manufacturer Part Number: GRM31CR60G227ME11L; Manufacturer: Murata Electronics North America; Part Description: 220µF ±20% 4V X5R Ceramic Capacitor -55°C ~ 85°C Surface Mount, MLCC 1206 (3216 Metric) 0.126" L x 0.063" W (3.20mm x 1.60mm); Capacitance: 220µF; Temperature Coefficient: X5R; Tolerance: ±20%; Package / Case: 1206 (3216 Metric); Supplier 1: Digi-Key; Packaging: Cut Tape (CT); Size / Dimension: 0.126" L x 0.063" W (3.20mm x 1.60mm); Operating Temperature: -55°C ~ 85°C; Voltage - Rated: 4V; Mounting Type: Surface Mount, MLCC; Ratings: -; Supplier Part Number 1: 490-9774-1-ND; Category: Capacitors; Lead Spacing: -; Lead Style: -; Applications: General Purpose; Features: -; Height - Seated (Max): -; Thickness (Max): 0.075" (1.90mm); RoHS: RoHS Compliant; Value: 220uF, 4V
C123 C129 C135 C141 C147 C153 C159 C165 = Cap_0603: Manufacturer Part Number 1: CC0603MRX5R5BB106; Part Description: 10µF ±20% 6.3V X5R Ceramic Capacitor -55°C ~ 85°C Surface Mount, MLCC 0603 (1608 Metric) 0.063" L x 0.031" W (1.60mm x 0.80mm); Manufacturer: Yageo; Capacitance: 10µF; Tolerance: ±20%; Supplier 1: Digi-Key; Supplier Part Number 1: 311-1448-2-ND; Package / Case: 0603 (1608 Metric); Category: Capacitors; Voltage - Rated: 6.3V; Value: 10uF, 6.3V
C124 C130 C136 C142 C148 C154 C160 C166 = Cap_0402: Manufacturer Part Number 1: GRM155R60J475ME87D; Manufacturer: Murata Electronics North America; Part Description: 4.7µF ±20% 6.3V X5R Ceramic Capacitor -55°C ~ 85°C Surface Mount, MLCC 0402 (1005 Metric) 0.039" L x 0.020" W (1.00mm x 0.50mm); Temperature Coefficient: X5R; Capacitance: 4.7µF; Tolerance: ±20%; Value: 4.7uF, 6.3V; Supplier 1: Digi-Key; Supplier Part Number 1: 490-5408-1-ND; Category: Capacitors; Voltage - Rated: 6.3V; Thickness (Max): 0.022" (0.55mm); Applications: General Purpose; Package / Case: 0402 (1005 Metric); Size / Dimension: 0.039" L x 0.020" W (1.00mm x 0.50mm); Features: Derating Recommended; Mounting Type: Surface Mount, MLCC; Ratings: -; Lead Style: -; Operating Temperature: -55°C ~ 85°C; Lead Spacing: -; RoHS: RoHS Compliant; Height - Seated (Max): -; Packaging: Cut Tape (CT)
C125 C131 C137 C143 C149 C155 C161 C167 = Cap_0402: Manufacturer Part Number 1: GRM155R61A105KE15J; Manufacturer: TDK; Part Description: 1µF ±10% 10V X5R Ceramic Capacitor -55°C ~ 85°C Surface Mount, MLCC 0402 (1005 Metric) 0.039" L x 0.020" W (1.00mm x 0.50mm); Voltage Rating: 10; Product Range: TDK - C Series; Ceramic Capacitor Case: 0402 [1005 Metric]; Capacitance: 1; Dielectric Characteristic: X6; Value: 1uF, 10%; Supplier 1: Newark; Supplier Part Number 1: 490-6298-2-ND; Capacitance Tolerance: ± 10%; MSL: -; RoHS: YES
C126 C132 C138 C144 C150 C156 C162 C168-C250 = Cap_0603: as C119 on sheet 10_FPGA_misc; Supplier 1: Mouser; Supplier Part Number 1: 81-GRM155R71C104KA88; Tolerance: 10 %; Case Code - in: 0402; Manufacturer: Murata Electronics; Category: Multilayer Ceramic Capacitors MLCC - SMD/SMT; Value: 100nF, 10%; Manufacturer Part Number: GRM155R71C104KA88D; Maximum Operating Temperature: + 125 C; Minimum Operating Temperature: - 55 C; Minimum Order Quantity: 1; Operating Temperature Range: - 55 C to + 125 C; Package / Case: 0402 (1005 metric); Packaging: Reel; Product: General Type MLCCs; Product Category: Low & Medium Capacitance SMD Ceramic Chip Capacitors; Reeling: True; RoHS - Mouser: Y; RoHS: RoHS Compliant; Series: GRM; Standard Pack Qty: 10000; Termination Style: SMD/SMT
C140 C146 C152 C157 C158 C163 C164 = Cap_1206: Manufacturer: MURATA; Manufacturer Part Number 1: GRM31CR60J107ME39L.; Part Description: SMD Multilayer Ceramic Capacitor, GRM Series, 100 µF, ± 20%, X5R, 6.3 V, 1206 [3216 Metric]; Capacitance Tolerance: ± 20%; Ceramic Capacitor Case: 1206 [3216 Metric]; Voltage Rating: 6.3; value: 100uF, 6.3V; Supplier Part Number 1: 1735535; Supplier 1: Farnell
FR36-FR39 = Ferrite: Manufacturer Part Number 1: MPZ2012S601AT000; Manufacturer: TDK Corporation; Part Description: FERRITE BEAD 600 OHM 0805 1LN; Filter Type: Differential Mode - Single; Impedance @ Frequency: 600 Ohm @ 100MHz; DC Resistance (DCR): 100 mOhm Max; Supplier 1: Digi-Key; Supplier Part Number 1: 445-2206-2-ND; Mounting Type: Surface Mount; RoHS: RoHS Compliant; Height (Max): 0.041" (1.05mm); Packaging: Tape & Reel (TR); Category: Filters; Current Rating: 2A; Package / Case: 0805 (2012 Metric); Size / Dimension: 0.079" L x 0.049" W (2.00mm x 1.25mm)
IC8 = EP4CGX30CF23C7N: as IC8 on sheet 10_FPGA_misc; Supplier 1: Digi-Key; Package / Case: 484-BGA; Operating Temperature: 0°C ~ 85°C; Mounting Type: Surface Mount; Number of Gates: -; Supplier Device Package: 484-FBGA (23x23); Category: Integrated Circuits (ICs); RoHS: RoHS Compliant; Supplier Part Number 1: 544-2730-ND; Manufacturer Part Number 1: EP4CGX30CF23C7N
R71 = Res_0402: Manufacturer: Yageo; Manufacturer Part Number: RC0402FR-072KL; Part Description: RES SMD 2K OHM 1% 1/16W 0402; Power (Watts): 0.063W, 1/16W; Temperature Coefficient: ±100ppm/°C; Packaging: Cut Tape (CT); Size / Dimension: 0.039" L x 0.020" W (1.00mm x 0.50mm); Operating Temperature: -55°C ~ 155°C; Resistance (Ohms): 2k; Number of Terminations: 2; Supplier Device Package: 0402; Tolerance: ±1%; Features: Moisture Resistant; Category: Resistors; Height: 0.016" (0.40mm); Composition: Thick Film; Supplier 1: Digi-Key; Supplier Part Number 1: 311-2KLRCT-ND; Package / Case: 0402 (1005 Metric); RoHS: RoHS Compliant; Value: 2k, 1%

## Sheet 12_DDR2.SchDoc: DDR2
size A3; Organization: Lime Microsystems; Address1: Surrey Tech Centre; Address2: Guildford GU2 7YG; Address3: Surrey; Address4: United Kingdom; Revision: v1.3; SheetNumber: 12; SheetTotal: 16
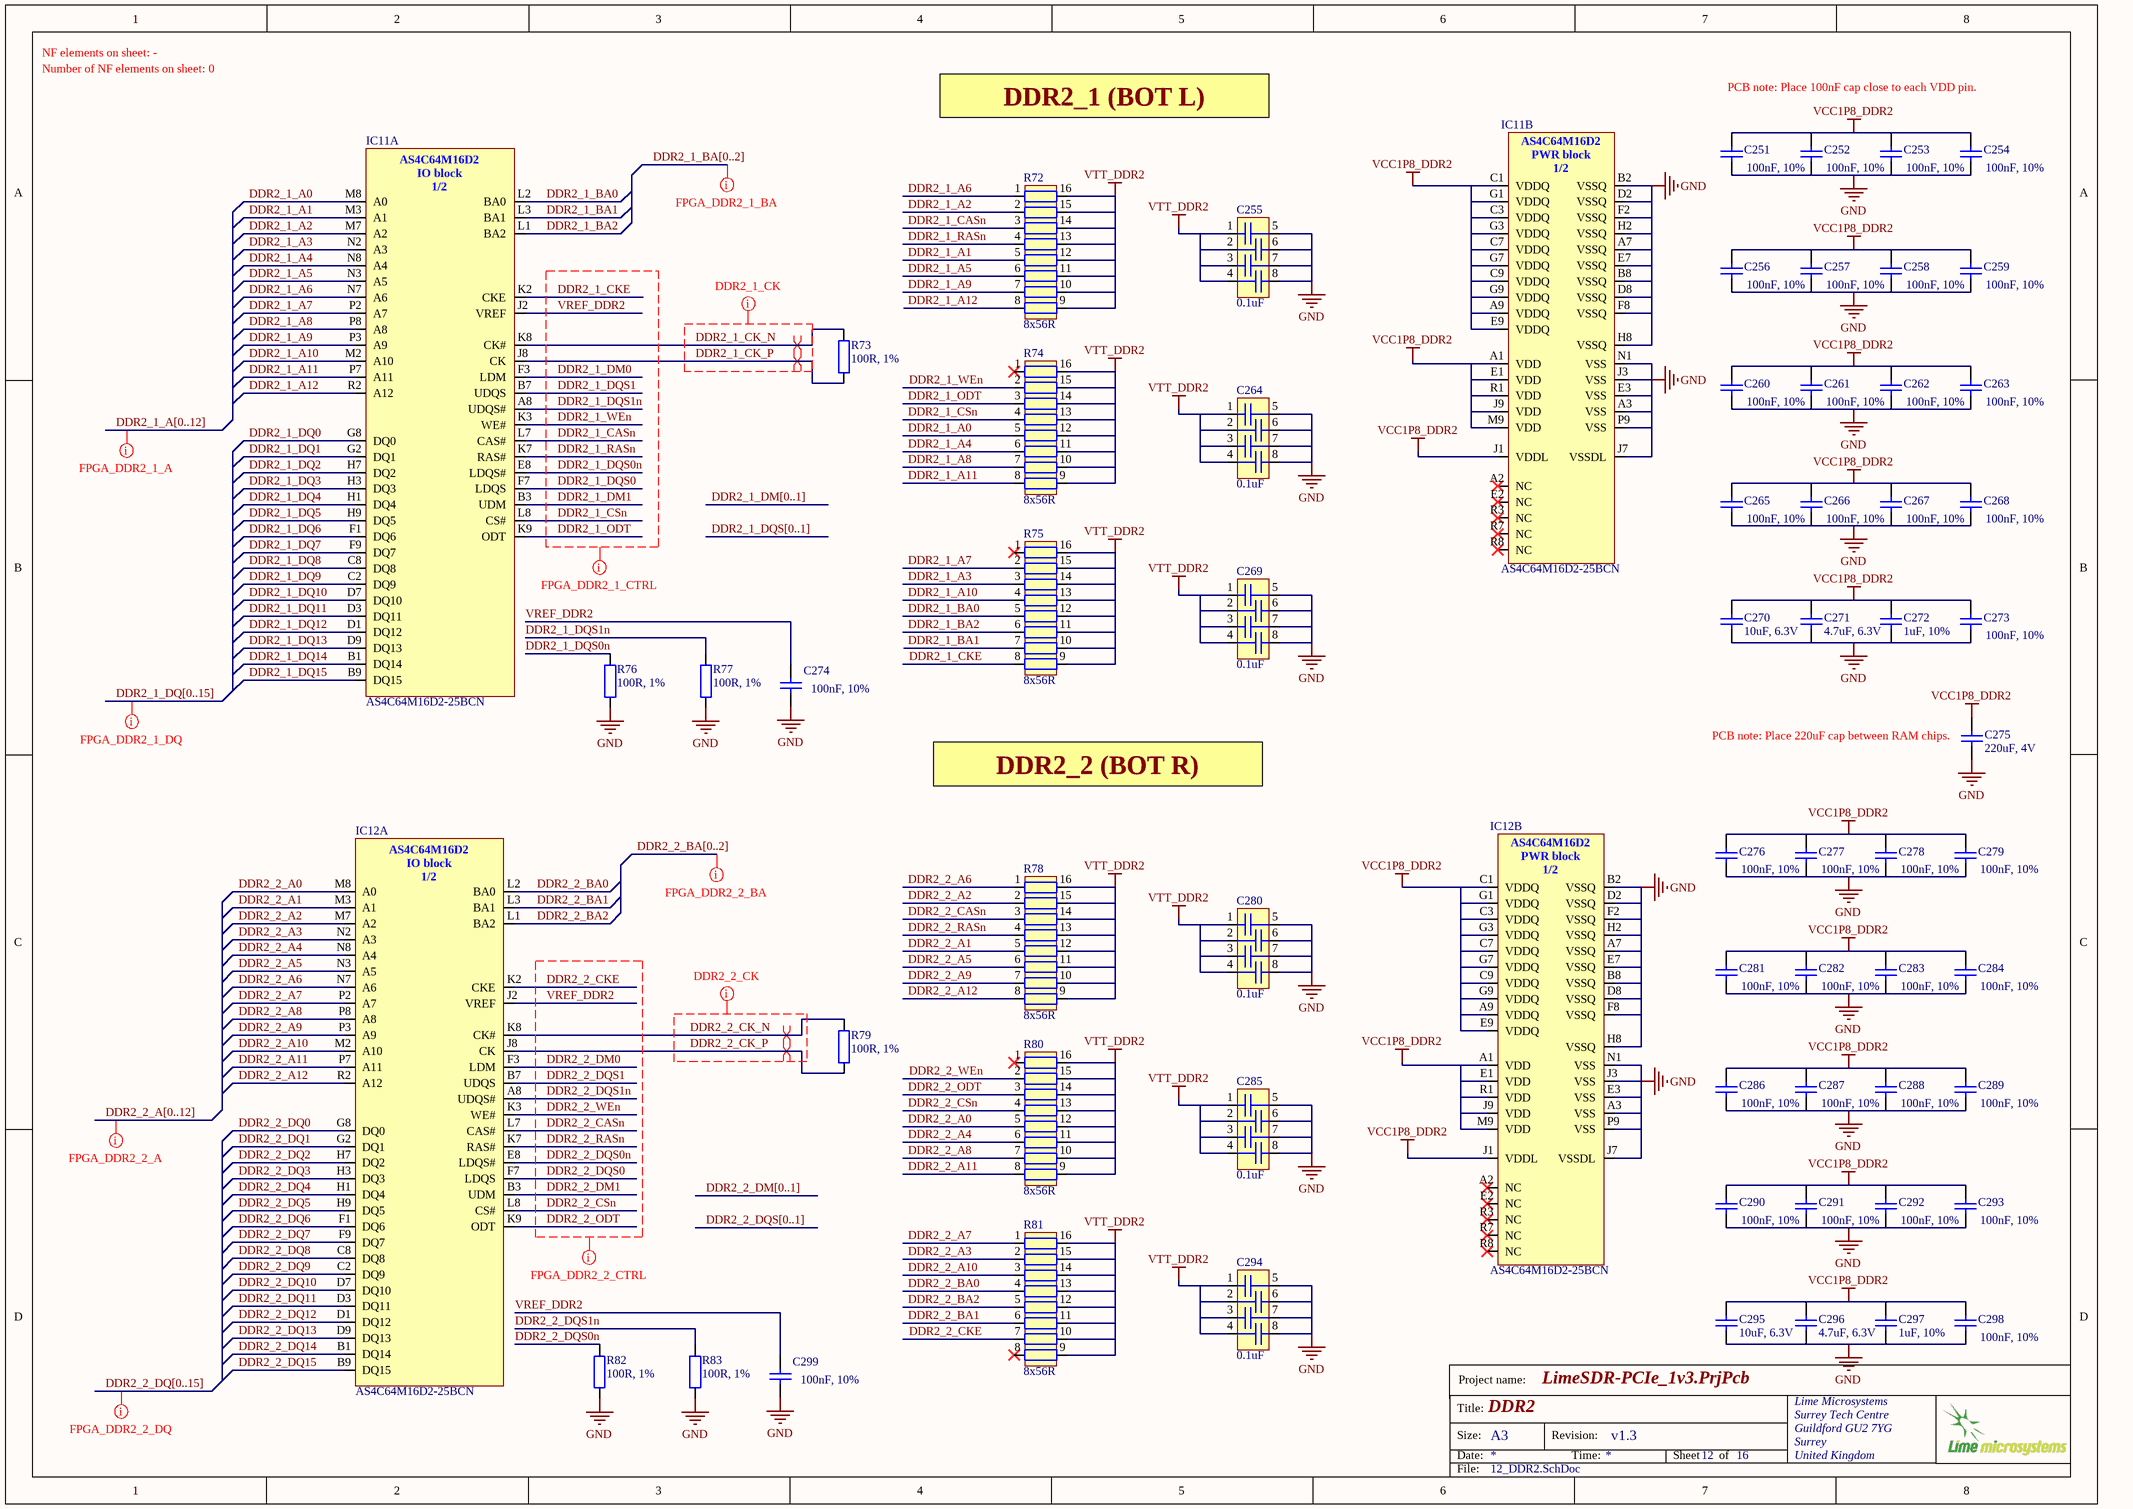
[diagram p12: 12_DDR2.SchDoc]

### Parts
C251  100nF, 10%  [CAP0402]
C252  100nF, 10%  [CAP0402]
C253  100nF, 10%  [CAP0402]
C254  100nF, 10%  [CAP0402]
C255  0.1uF  [CKCA43X7R1C104M100AA]
C256  100nF, 10%  [CAP0402]
C257  100nF, 10%  [CAP0402]
C258  100nF, 10%  [CAP0402]
C259  100nF, 10%  [CAP0402]
C260  100nF, 10%  [CAP0402]
C261  100nF, 10%  [CAP0402]
C262  100nF, 10%  [CAP0402]
C263  100nF, 10%  [CAP0402]
C264  0.1uF  [CKCA43X7R1C104M100AA]
C265  100nF, 10%  [CAP0402]
C266  100nF, 10%  [CAP0402]
C267  100nF, 10%  [CAP0402]
C268  100nF, 10%  [CAP0402]
C269  0.1uF  [CKCA43X7R1C104M100AA]
C270  10uF, 6.3V  [CAP0603]
C271  4.7uF, 6.3V  [CAP0402]
C272  1uF, 10%  [CAP0402]
C273  100nF, 10%  [CAP0402]
C274  100nF, 10%  [CAP0402]
C275  220uF, 4V  [CAP1206]
C276  100nF, 10%  [CAP0402]
C277  100nF, 10%  [CAP0402]
C278  100nF, 10%  [CAP0402]
C279  100nF, 10%  [CAP0402]
C280  0.1uF  [CKCA43X7R1C104M100AA]
C281  100nF, 10%  [CAP0402]
C282  100nF, 10%  [CAP0402]
C283  100nF, 10%  [CAP0402]
C284  100nF, 10%  [CAP0402]
C285  0.1uF  [CKCA43X7R1C104M100AA]
C286  100nF, 10%  [CAP0402]
C287  100nF, 10%  [CAP0402]
C288  100nF, 10%  [CAP0402]
C289  100nF, 10%  [CAP0402]
C290  100nF, 10%  [CAP0402]
C291  100nF, 10%  [CAP0402]
C292  100nF, 10%  [CAP0402]
C293  100nF, 10%  [CAP0402]
C294  0.1uF  [CKCA43X7R1C104M100AA]
C295  10uF, 6.3V  [CAP0603]
C296  4.7uF, 6.3V  [CAP0402]
C297  1uF, 10%  [CAP0402]
C298  100nF, 10%  [CAP0402]
C299  100nF, 10%  [CAP0402]
IC11  AS4C64M16D2-25BCN  [AS4C64M16D2]  (parts A,B of 2)
IC12  AS4C64M16D2-25BCN  [AS4C64M16D2]  (parts A,B of 2)
R72  8x56R  [EXB2HV]
R73  100R, 1%  [RES0402]
R74  8x56R  [EXB2HV]
R75  8x56R  [EXB2HV]
R76  100R, 1%  [RES0402]
R77  100R, 1%  [RES0402]
R78  8x56R  [EXB2HV]
R79  100R, 1%  [RES0402]
R80  8x56R  [EXB2HV]
R81  8x56R  [EXB2HV]
R82  100R, 1%  [RES0402]
R83  100R, 1%  [RES0402]

### Nets
GND: C251.2 C252.2 C253.2 C254.2 C255.5 C255.6 C255.7 C255.8 C256.2 C257.2 C258.2 C259.2 C260.2 C261.2 C262.2 C263.2 C264.5 C264.6 C264.7 C264.8 C265.2 C266.2 C267.2 C268.2 C269.5 C269.6 C269.7 C269.8 C270.1 C271.1 C272.1 C273.2 C274.2 C275.1 C276.2 C277.2 C278.2 C279.2 C280.5 C280.6 C280.7 C280.8 C281.2 C282.2 C283.2 C284.2 C285.5 C285.6 C285.7 C285.8 C286.2 C287.2 C288.2 C289.2 C290.2 C291.2 C292.2 C293.2 C294.5 C294.6 C294.7 C294.8 C295.1 C296.1 C297.1 C298.2 C299.2 IC11.A3(VSS) IC11.A7(VSSQ) IC11.B2(VSSQ) IC11.B8(VSSQ) IC11.D2(VSSQ) IC11.D8(VSSQ) IC11.E3(VSS) IC11.E7(VSSQ) IC11.F2(VSSQ) IC11.F8(VSSQ) IC11.H2(VSSQ) IC11.H8(VSSQ) IC11.J3(VSS) IC11.J7(VSSDL) IC11.N1(VSS) IC11.P9(VSS) IC12.A3(VSS) IC12.A7(VSSQ) IC12.B2(VSSQ) IC12.B8(VSSQ) IC12.D2(VSSQ) IC12.D8(VSSQ) IC12.E3(VSS) IC12.E7(VSSQ) IC12.F2(VSSQ) IC12.F8(VSSQ) IC12.H2(VSSQ) IC12.H8(VSSQ) IC12.J3(VSS) IC12.J7(VSSDL) IC12.N1(VSS) IC12.P9(VSS) R76.1 R77.1 R82.1 R83.1
VCC1P8_DDR2: C251.1 C252.1 C253.1 C254.1 C256.1 C257.1 C258.1 C259.1 C260.1 C261.1 C262.1 C263.1 C265.1 C266.1 C267.1 C268.1 C270.2 C271.2 C272.2 C273.1 C275.2 C276.1 C277.1 C278.1 C279.1 C281.1 C282.1 C283.1 C284.1 C286.1 C287.1 C288.1 C289.1 C290.1 C291.1 C292.1 C293.1 C295.2 C296.2 C297.2 C298.1 IC11.A1(VDD) IC11.A9(VDDQ) IC11.C1(VDDQ) IC11.C3(VDDQ) IC11.C7(VDDQ) IC11.C9(VDDQ) IC11.E1(VDD) IC11.E9(VDDQ) IC11.G1(VDDQ) IC11.G3(VDDQ) IC11.G7(VDDQ) IC11.G9(VDDQ) IC11.J1(VDDL) IC11.J9(VDD) IC11.M9(VDD) IC11.R1(VDD) IC12.A1(VDD) IC12.A9(VDDQ) IC12.C1(VDDQ) IC12.C3(VDDQ) IC12.C7(VDDQ) IC12.C9(VDDQ) IC12.E1(VDD) IC12.E9(VDDQ) IC12.G1(VDDQ) IC12.G3(VDDQ) IC12.G7(VDDQ) IC12.G9(VDDQ) IC12.J1(VDDL) IC12.J9(VDD) IC12.M9(VDD) IC12.R1(VDD)
VREF_DDR2: C274.1 C299.1 IC11.J2(VREF) IC12.J2(VREF)
VTT_DDR2: C255.1 C255.2 C255.3 C255.4 C264.1 C264.2 C264.3 C264.4 C269.1 C269.2 C269.3 C269.4 C280.1 C280.2 C280.3 C280.4 C285.1 C285.2 C285.3 C285.4 C294.1 C294.2 C294.3 C294.4 R72.9 R72.10 R72.11 R72.12 R72.13 R72.14 R72.15 R72.16 R74.9 R74.10 R74.11 R74.12 R74.13 R74.14 R74.15 R74.16 R75.9 R75.10 R75.11 R75.12 R75.13 R75.14 R75.15 R75.16 R78.9 R78.10 R78.11 R78.12 R78.13 R78.14 R78.15 R78.16 R80.9 R80.10 R80.11 R80.12 R80.13 R80.14 R80.15 R80.16 R81.9 R81.10 R81.11 R81.12 R81.13 R81.14 R81.15 R81.16
DDR2_1_A0: IC11.M8(A0) R74.5
DDR2_1_A1: IC11.M3(A1) R72.5
DDR2_1_A2: IC11.M7(A2) R72.2
DDR2_1_A3: IC11.N2(A3) R75.3
DDR2_1_A4: IC11.N8(A4) R74.6
DDR2_1_A5: IC11.N3(A5) R72.6
DDR2_1_A6: IC11.N7(A6) R72.1
DDR2_1_A7: IC11.P2(A7) R75.2
DDR2_1_A8: IC11.P8(A8) R74.7
DDR2_1_A9: IC11.P3(A9) R72.7
DDR2_1_A10: IC11.M2(A10) R75.4
DDR2_1_A11: IC11.P7(A11) R74.8
DDR2_1_A12: IC11.R2(A12) R72.8
DDR2_1_BA0: IC11.L2(BA0) R75.5
DDR2_1_BA1: IC11.L3(BA1) R75.7
DDR2_1_BA2: IC11.L1(BA2) R75.6
DDR2_1_CASn: IC11.L7(CAS#) R72.3
DDR2_1_CK_N: IC11.K8(CK#) R73.2
DDR2_1_CK_P: IC11.J8(CK) R73.1
DDR2_1_CKE: IC11.K2(CKE) R75.8
DDR2_1_CSn: IC11.L8(CS#) R74.4
DDR2_1_DM0: IC11.F3(LDM)
DDR2_1_DM1: IC11.B3(UDM)
DDR2_1_DQ0: IC11.G8(DQ0)
DDR2_1_DQ1: IC11.G2(DQ1)
DDR2_1_DQ2: IC11.H7(DQ2)
DDR2_1_DQ3: IC11.H3(DQ3)
DDR2_1_DQ4: IC11.H1(DQ4)
DDR2_1_DQ5: IC11.H9(DQ5)
DDR2_1_DQ6: IC11.F1(DQ6)
DDR2_1_DQ7: IC11.F9(DQ7)
DDR2_1_DQ8: IC11.C8(DQ8)
DDR2_1_DQ9: IC11.C2(DQ9)
DDR2_1_DQ10: IC11.D7(DQ10)
DDR2_1_DQ11: IC11.D3(DQ11)
DDR2_1_DQ12: IC11.D1(DQ12)
DDR2_1_DQ13: IC11.D9(DQ13)
DDR2_1_DQ14: IC11.B1(DQ14)
DDR2_1_DQ15: IC11.B9(DQ15)
DDR2_1_DQS0: IC11.F7(LDQS)
DDR2_1_DQS0n: IC11.E8(LDQS#) R76.2
DDR2_1_DQS1: IC11.B7(UDQS)
DDR2_1_DQS1n: IC11.A8(UDQS#) R77.2
DDR2_1_ODT: IC11.K9(ODT) R74.3
DDR2_1_RASn: IC11.K7(RAS#) R72.4
DDR2_1_WEn: IC11.K3(WE#) R74.2
DDR2_2_A0: IC12.M8(A0) R80.5
DDR2_2_A1: IC12.M3(A1) R78.5
DDR2_2_A2: IC12.M7(A2) R78.2
DDR2_2_A3: IC12.N2(A3) R81.2
DDR2_2_A4: IC12.N8(A4) R80.6
DDR2_2_A5: IC12.N3(A5) R78.6
DDR2_2_A6: IC12.N7(A6) R78.1
DDR2_2_A7: IC12.P2(A7) R81.1
DDR2_2_A8: IC12.P8(A8) R80.7
DDR2_2_A9: IC12.P3(A9) R78.7
DDR2_2_A10: IC12.M2(A10) R81.3
DDR2_2_A11: IC12.P7(A11) R80.8
DDR2_2_A12: IC12.R2(A12) R78.8
DDR2_2_BA0: IC12.L2(BA0) R81.4
DDR2_2_BA1: IC12.L3(BA1) R81.6
DDR2_2_BA2: IC12.L1(BA2) R81.5
DDR2_2_CASn: IC12.L7(CAS#) R78.3
DDR2_2_CK_N: IC12.K8(CK#) R79.2
DDR2_2_CK_P: IC12.J8(CK) R79.1
DDR2_2_CKE: IC12.K2(CKE) R81.7
DDR2_2_CSn: IC12.L8(CS#) R80.4
DDR2_2_DM0: IC12.F3(LDM)
DDR2_2_DM1: IC12.B3(UDM)
DDR2_2_DQ0: IC12.G8(DQ0)
DDR2_2_DQ1: IC12.G2(DQ1)
DDR2_2_DQ2: IC12.H7(DQ2)
DDR2_2_DQ3: IC12.H3(DQ3)
DDR2_2_DQ4: IC12.H1(DQ4)
DDR2_2_DQ5: IC12.H9(DQ5)
DDR2_2_DQ6: IC12.F1(DQ6)
DDR2_2_DQ7: IC12.F9(DQ7)
DDR2_2_DQ8: IC12.C8(DQ8)
DDR2_2_DQ9: IC12.C2(DQ9)
DDR2_2_DQ10: IC12.D7(DQ10)
DDR2_2_DQ11: IC12.D3(DQ11)
DDR2_2_DQ12: IC12.D1(DQ12)
DDR2_2_DQ13: IC12.D9(DQ13)
DDR2_2_DQ14: IC12.B1(DQ14)
DDR2_2_DQ15: IC12.B9(DQ15)
DDR2_2_DQS0: IC12.F7(LDQS)
DDR2_2_DQS0n: IC12.E8(LDQS#) R82.2
DDR2_2_DQS1: IC12.B7(UDQS)
DDR2_2_DQS1n: IC12.A8(UDQS#) R83.2
DDR2_2_ODT: IC12.K9(ODT) R80.3
DDR2_2_RASn: IC12.K7(RAS#) R78.4
DDR2_2_WEn: IC12.K3(WE#) R80.2

Not connected (* = marked no-connect by the designer): IC11 A2(NC)* E2(NC)* R3(NC)* R7(NC)* R8(NC)*; IC12 A2(NC)* E2(NC)* R3(NC)* R7(NC)* R8(NC)*; R74 1*; R75 1*; R80 1*; R81 8*

### Buses and harness runs
bus DDR2_1_A[0..12]
bus DDR2_1_BA[0..2]
bus DDR2_1_DM[0..1]
bus DDR2_1_DQ[0..15]
bus DDR2_1_DQS[0..1]
bus DDR2_2_A[0..12]
bus DDR2_2_BA[0..2]
bus DDR2_2_DM[0..1]
bus DDR2_2_DQ[0..15]
bus DDR2_2_DQS[0..1]

### Layout directives
net class FPGA_DDR0_DQ: (no net found under the mark)
net class FPGA_DDR0_BA: (no net found under the mark)
net class FPGA_DDR0_CTRL: DDR2_1_CASn, DDR2_1_CKE, DDR2_1_CSn, DDR2_1_DM0, DDR2_1_DM1, DDR2_1_DQS0, DDR2_1_DQS0n, DDR2_1_DQS1, DDR2_1_DQS1n, DDR2_1_ODT, DDR2_1_RASn, DDR2_1_WEn, VREF_DDR2
net class FPGA_DDR0_A: (no net found under the mark)
net class FPGA_DDR1_DQ: (no net found under the mark)
net class FPGA_DDR1_BA: (no net found under the mark)
net class FPGA_DDR1_CTRL: DDR2_2_CASn, DDR2_2_CKE, DDR2_2_CSn, DDR2_2_DM0, DDR2_2_DM1, DDR2_2_DQS0, DDR2_2_DQS0n, DDR2_2_DQS1, DDR2_2_DQS1n, DDR2_2_ODT, DDR2_2_RASn, DDR2_2_WEn, VREF_DDR2
net class FPGA_DDR1_A: (no net found under the mark)
differential pair: DDR2_1_CK_N, DDR2_1_CK_P, DDR2_2_CK_N, DDR2_2_CK_P
net class DDR2_2_CK: DDR2_2_CK_N, DDR2_2_CK_P
net class DDR2_1_CK: DDR2_1_CK_N, DDR2_1_CK_P

### Notes on the sheet
- Number of NF elements on sheet: 0
- NF elements on sheet: -
- DDR2_1 (BOT L)
- PCB note: Place 100nF cap close to each VDD pin.
- DDR2_2 (BOT R)
- (near C275) PCB note: Place 220uF cap between RAM chips.
- Project name:
- Title:
- Size:
- Date:
- A3
- Revision:
- Time:
- Sheet
- of
- File:
- (in symbol AS4C64M16D2-25BCN, part A) AS4C64M16D2 / IO block / 1/2
- (in symbol AS4C64M16D2-25BCN, part B) AS4C64M16D2 / PWR block / 1/2

### Library data of the parts
C251-C254 C256-C263 C265-C268 C273 C274 C276-C279 C281-C284 C286-C293 C298 C299 = Cap_0603: as C119 on sheet 10_FPGA_misc; Supplier 1: Mouser; Supplier Part Number 1: 81-GRM155R71C104KA88; Tolerance: 10 %; Case Code - in: 0402; Manufacturer: Murata Electronics; Category: Multilayer Ceramic Capacitors MLCC - SMD/SMT; Value: 100nF, 10%; Manufacturer Part Number: GRM155R71C104KA88D; Maximum Operating Temperature: + 125 C; Minimum Operating Temperature: - 55 C; Minimum Order Quantity: 1; Operating Temperature Range: - 55 C to + 125 C; Package / Case: 0402 (1005 metric); Packaging: Reel; Product: General Type MLCCs; Product Category: Low & Medium Capacitance SMD Ceramic Chip Capacitors; Reeling: True; RoHS - Mouser: Y; RoHS: RoHS Compliant; Series: GRM; Standard Pack Qty: 10000; Termination Style: SMD/SMT
C255 C264 C269 C280 C285 C294 = 4X_cap_array_1206: Manufacturer: TDK; Part Description: CAP ARRAY 0.1UF 16V X7R 1206; Case Height: 1 mm; Case Length: 3.2 mm; Case Width: 1.6 mm; Voltage Rating: 16 V; Number of Elements: 4; Tolerance: 20 %; Temperature Coefficient / Code: X7R; Value: 0.1uF; Supplier 1: Mouser; Supplier Part Number 1: 810-CKCA43X7R1C104M; RoHS: RoHS Compliant; Termination Style: SMD/SMT; Brand: TDK; Category: Capacitor Arrays & Networks; Product: Ceramic Capacitor Arrays; Series: CKC; Packaging: Reel; Operating Temperature Range: - 55 C to + 125 C; Manufacturer Part Number 1: CKCA43X7R1C104M100AA; Capacitance: 0.1 uF; Product Category: Capacitor Arrays; Standard Pack Qty: 2000; RoHS - Mouser: Y; Minimum Order Quantity: 1; Reeling: True
C270 C295 = Cap_0603: as C123 on sheet 11_FPGA_power; Supplier 1: Digi-Key; Supplier Part Number 1: 311-1448-2-ND; Package / Case: 0603 (1608 Metric); Category: Capacitors; Voltage - Rated: 6.3V; Value: 10uF, 6.3V
C271 C296 = Cap_0402: as C124 on sheet 11_FPGA_power; Value: 4.7uF, 6.3V; Supplier 1: Digi-Key; Supplier Part Number 1: 490-5408-1-ND; Category: Capacitors; Voltage - Rated: 6.3V; Thickness (Max): 0.022" (0.55mm); Applications: General Purpose; Package / Case: 0402 (1005 Metric); Size / Dimension: 0.039" L x 0.020" W (1.00mm x 0.50mm); Features: Derating Recommended; Mounting Type: Surface Mount, MLCC; Ratings: -; Lead Style: -; Operating Temperature: -55°C ~ 85°C; Lead Spacing: -; RoHS: RoHS Compliant; Height - Seated (Max): -; Packaging: Cut Tape (CT)
C272 C297 = Cap_0402: as C125 on sheet 11_FPGA_power; Value: 1uF, 10%; Supplier 1: Newark; Supplier Part Number 1: 490-6298-2-ND; Capacitance Tolerance: ± 10%; MSL: -; RoHS: YES
C275 = Cap_1206: as C120 on sheet 11_FPGA_power; Package / Case: 1206 (3216 Metric); Supplier 1: Digi-Key; Packaging: Cut Tape (CT); Size / Dimension: 0.126" L x 0.063" W (3.20mm x 1.60mm); Operating Temperature: -55°C ~ 85°C; Voltage - Rated: 4V; Mounting Type: Surface Mount, MLCC; Ratings: -; Supplier Part Number 1: 490-9774-1-ND; Category: Capacitors; Lead Spacing: -; Lead Style: -; Applications: General Purpose; Features: -; Height - Seated (Max): -; Thickness (Max): 0.075" (1.90mm); RoHS: RoHS Compliant; Value: 220uF, 4V
IC11 IC12 = AS4C64M16D2-25BCN: Manufacturer: Alliance Memory, Inc.; Part Description: IC SDRAM 64MX16 1.8V 84-FBGA; Speed: 400MHz; Interface: Parallel; Memory Type: DDR2 SDRAM; Memory Size: 1G (64M x 16); Voltage - Supply: 1.7 V ~ 1.9 V; Format - Memory: RAM; Supplier 1: Digi-Key; Package / Case: 84-TFBGA; Supplier Device Package: 84-FBGA (8x12.5); Manufacturer Part Number 1: AS4C64M16D2-25BCN; RoHS: RoHS Compliant; Operating Temperature: 0°C ~ 70°C; Category: Integrated Circuits (ICs); Packaging: Tray; Supplier Part Number 1: 1450-1158-ND
R72 R74 R75 R78 R80 R81 = 8X_resistor_array_0402: Manufacturer Part Number 1: EXB2HV560JV; Manufacturer: PANASONIC ELECTRONIC COMPONENTS; Part Description: RESISTOR,CVEX ARRAY,0402X8, 56R 5%; Supplier 1: Farnell; Supplier Part Number 1: 2060070; RoHS: YES
R73 R76 R77 R79 R82 R83 = Res_0402: Manufacturer Part Number 1: RMCF0402FT100R; Part Description: RES SMD 100 OHM 1% 1/16W 0402; Manufacturer: Stackpole Electronics Inc.; Temperature Coefficient: ±100ppm/°C; Supplier 1: Digi-Key; Supplier Part Number 1: RMCF0402FT100RDKR-ND; Package / Case: 0402 (1005 Metric); Composition: Thick Film; Category: Resistors; Tolerance: ±1%; Value: 100R, 1%